# EAGLE schematic ftExtender2v0 (EAGLE 8.3.2)
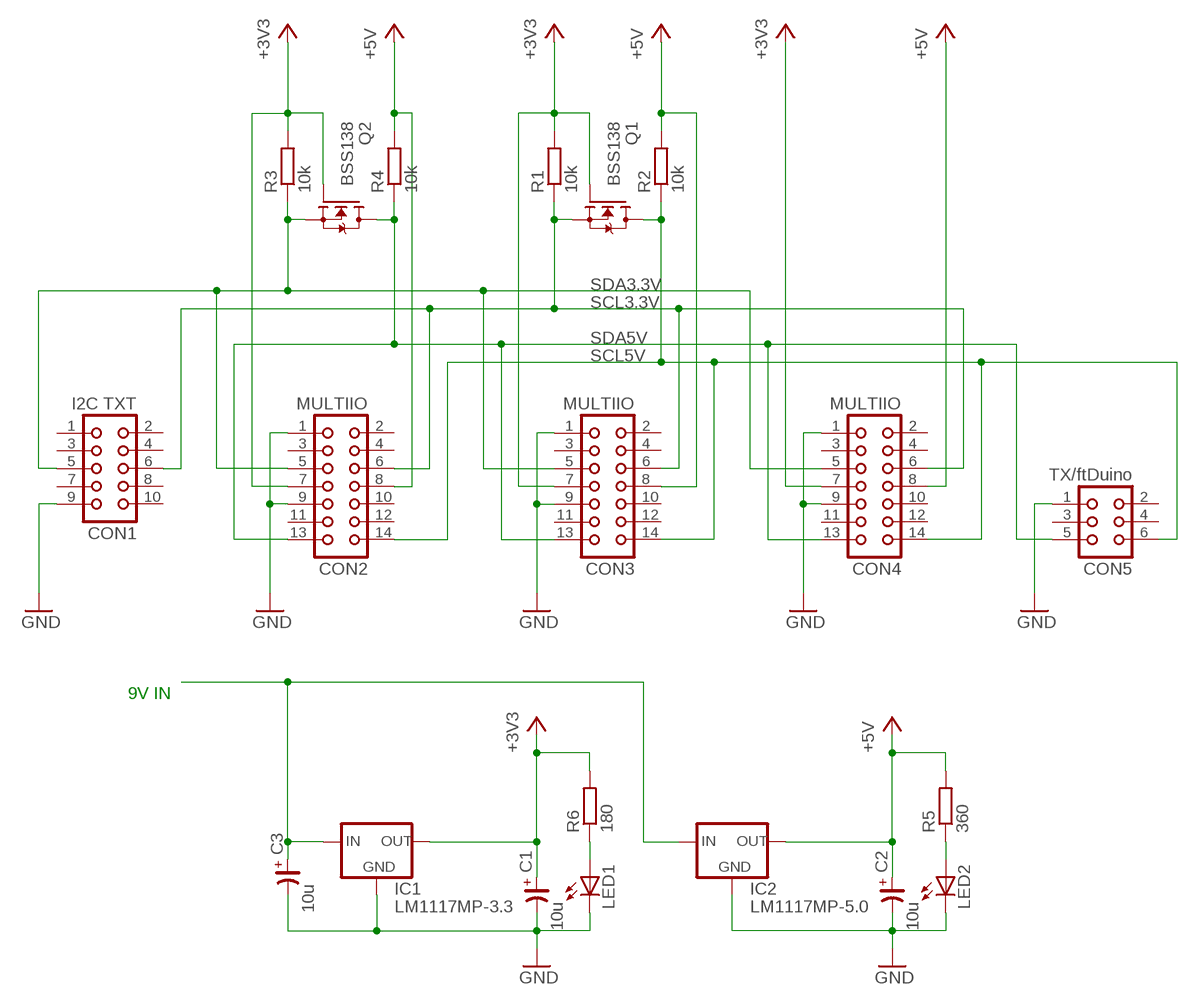
[diagram p0: schematic, sheet 1]

## Parts
C1  10u  CP_6032  [C6032/T]
C2  10u  CP_6032  [C6032/T]
C3  10u  CP_6032  [C6032/T]
CON1  I2C TXT  CON10  [CON10]
CON2  MULTIIO  CON14  [CON14]
CON3  MULTIIO  CON14  [CON14]
CON4  MULTIIO  CON14  [CON14]
CON5  TX/ftDuino  CON06  [CON06]
IC1  LM1117MP-3.3  [SOT223]
IC2  LM1117MP-5.0  [SOT223]
LED1  LEDCHIP-LED0805  [CHIP-LED0805]
LED2  LEDCHIP-LED0805  [CHIP-LED0805]
Q1  BSS138  [SOT23]
Q2  BSS138  [SOT23]
R1  10k  R-EU_R1206  [R1206]
R2  10k  R-EU_R1206  [R1206]
R3  10k  R-EU_R1206  [R1206]
R4  10k  R-EU_R1206  [R1206]
R5  360  R-EU_R1206  [R1206]
R6  180  R-EU_R1206  [R1206]

## Nets
+3V3: C1.+ CON2.7 CON3.7 CON4.7 IC1.2(OUT) IC1.4(OUT) Q1.1(G) Q2.1(G) R1.2 R3.2 R6.2
+5V: C2.+ CON2.8 CON3.8 CON4.8 IC2.2(OUT) IC2.4(OUT) R2.2 R4.2 R5.2
GND: C1.- C2.- C3.- CON1.9 CON2.1 CON2.9 CON3.1 CON3.9 CON4.1 CON4.9 CON5.1 IC1.1(GND) IC2.1(GND) LED1.C LED2.C
N$3: C3.+ IC1.3(IN) IC2.3(IN)
N$4: LED2.A R5.1
N$6: LED1.A R6.1
SCL3.3V: CON1.6 CON2.6 CON3.6 CON4.6 Q1.2(S) R1.1
SCL5V: CON2.14 CON3.14 CON4.14 CON5.6 Q1.3(D) R2.1
SDA3.3V: CON1.5 CON2.5 CON3.5 CON4.5 Q2.2(S) R3.1
SDA5V: CON2.13 CON3.13 CON4.13 CON5.5 Q2.3(D) R4.1
Unconnected: CON1.1 CON1.2 CON1.3 CON1.4 CON1.7 CON1.8 CON1.10 CON2.2 CON2.3 CON2.4 CON2.10 CON2.11 CON2.12 CON3.2 CON3.3 CON3.4 CON3.10 CON3.11 CON3.12 CON4.2 CON4.3 CON4.4 CON4.10 CON4.11 CON4.12 CON5.2 CON5.3 CON5.4

## Notes on the sheet
- 9V IN

## Library data of the parts
C1-C3 = rc-master-smd:CP_: POLARIZED CAP
CON1 = con-harting:CON10: CONNECTOR; OC_FARNELL: unknown; OC_NEWARK: unknown
CON2-CON4 = con-harting:CON14: CONNECTOR; OC_FARNELL: unknown; OC_NEWARK: unknown
CON5 = con-harting:CON06: CONNECTOR; OC_FARNELL: unknown; OC_NEWARK: unknown
IC1 = lm1117_10:LM1117?-*: 800mA Low-Dropout Linear Regulator Source: http://www.ti.com/lit/ds/symlink/lm1117-n.pdf; MF: Texas Instruments; MPN: LM1117MP-3.3; OC_FARNELL: 9778195; OC_NEWARK: 28X3416
IC2 = lm1117_10:LM1117?-*: 800mA Low-Dropout Linear Regulator Source: http://www.ti.com/lit/ds/symlink/lm1117-n.pdf; MF: Texas Instruments; MPN: LM1117MP-5.0; OC_FARNELL: 9778209; OC_NEWARK: 28X3417
LED1 LED2 = led:LED: LED OSRAM: - CHIPLED LG R971, LG N971, LY N971, LG Q971, LY Q971, LO R971, LY R971 LH N974, LH R974 LS Q976, LO Q976, LY Q976 LO Q996 - Hyper CHIPLED LW Q18S LB Q993, LB Q99A, LB R99A - SideLED LS A670, LO A670, LY A670, LG A670, LP A670 LB A673, LV A673, LT A673, LW A673 LH A674 LY A675 LS A676, LA A676, LO A676, LY A676, LW A676 LS A679, LY A679, LG A679 - Hyper Micro SIDELED® LS Y876, LA Y876, LO Y876, LY Y876 LT Y87S - SmartLED LW L88C, LW L88S LB L89C, LB L89S, LG L890 LS L89K, LO L89K, LY L89K LS L896, LA L896, LO L896, LY L896 - TOPLED LS T670, LO T670, LY T670, LG T670, LP T670 LSG T670, LSP T670, LSY T670, LOP T670, LYG T670 LG T671, LOG T671, LSG T671 LB T673, LV T673, LT T673, LW T673 LH T674 LS T676, LA T676, LO T676, LY T676, LB T676, LH T676, LSB T676, LW T676 LB T67C, LV T67C, LT T67C, LS T67K, LO T67K, LY T67K, LW E67C LS E67B, LA E67B, LO E67B, LY E67B, LB E67C, LV E67C, LT E67C LW T67C LS T679, LY T679, LG T679 LS T770, LO T770, LY T770, LG T770, LP T770 LB T773, LV T773, LT T773, LW T773 LH T774 LS E675, LA E675, LY E675, LS T675 LS T776, LA T776, LO T776, LY T776, LB T776 LHGB T686 LT T68C, LB T68C - Hyper Mini TOPLED® LB M676 - Mini TOPLED Santana® LG M470 LS M47K, LO M47K, LY M47K Source: http://www.osram.convergy.de LUXEON: - LUMILED® LXK2-PW12-R00, LXK2-PW12-S00, LXK2-PW14-U00, LXK2-PW14-V00 LXK2-PM12-R00, LXK2-PM12-S00, LXK2-PM14-U00 LXK2-PE12-Q00, LXK2-PE12-R00, LXK2-PE12-S00, LXK2-PE14-T00, LXK2-PE14-U00 LXK2-PB12-K00, LXK2-PB12-L00, LXK2-PB12-M00, LXK2-PB14-N00, LXK2-PB14-P00, LXK2-PB14-Q00 LXK2-PR12-L00, LXK2-PR12-M00, LXK2-PR14-Q00, LXK2-PR14-R00 LXK2-PD12-Q00, LXK2-PD12-R00, LXK2-PD12-S00 LXK2-PH12-R00, LXK2-PH12-S00 LXK2-PL12-P00, LXK2-PL12-Q00, LXK2-PL12-R00 Source: www.luxeon.com KINGBRIGHT: KA-3528ASYC Source: www.kingbright.com
Q1 Q2 = bss138_10:BSS138: BSS138 N-Channel Logic Level Enhancement Mode Field Effect Transistor Source: http://www.fairchildsemi.com/datasheets/BS/BSS138.pdf; MF: Fairchild; MPN: BSS138; OC_FARNELL: 9845330; OC_NEWARK: 67R2009
R1-R6 = resistor:R-EU_: RESISTOR, European symbol